# Altium schematic sheet Voltage_inverter.SchDoc
size A1
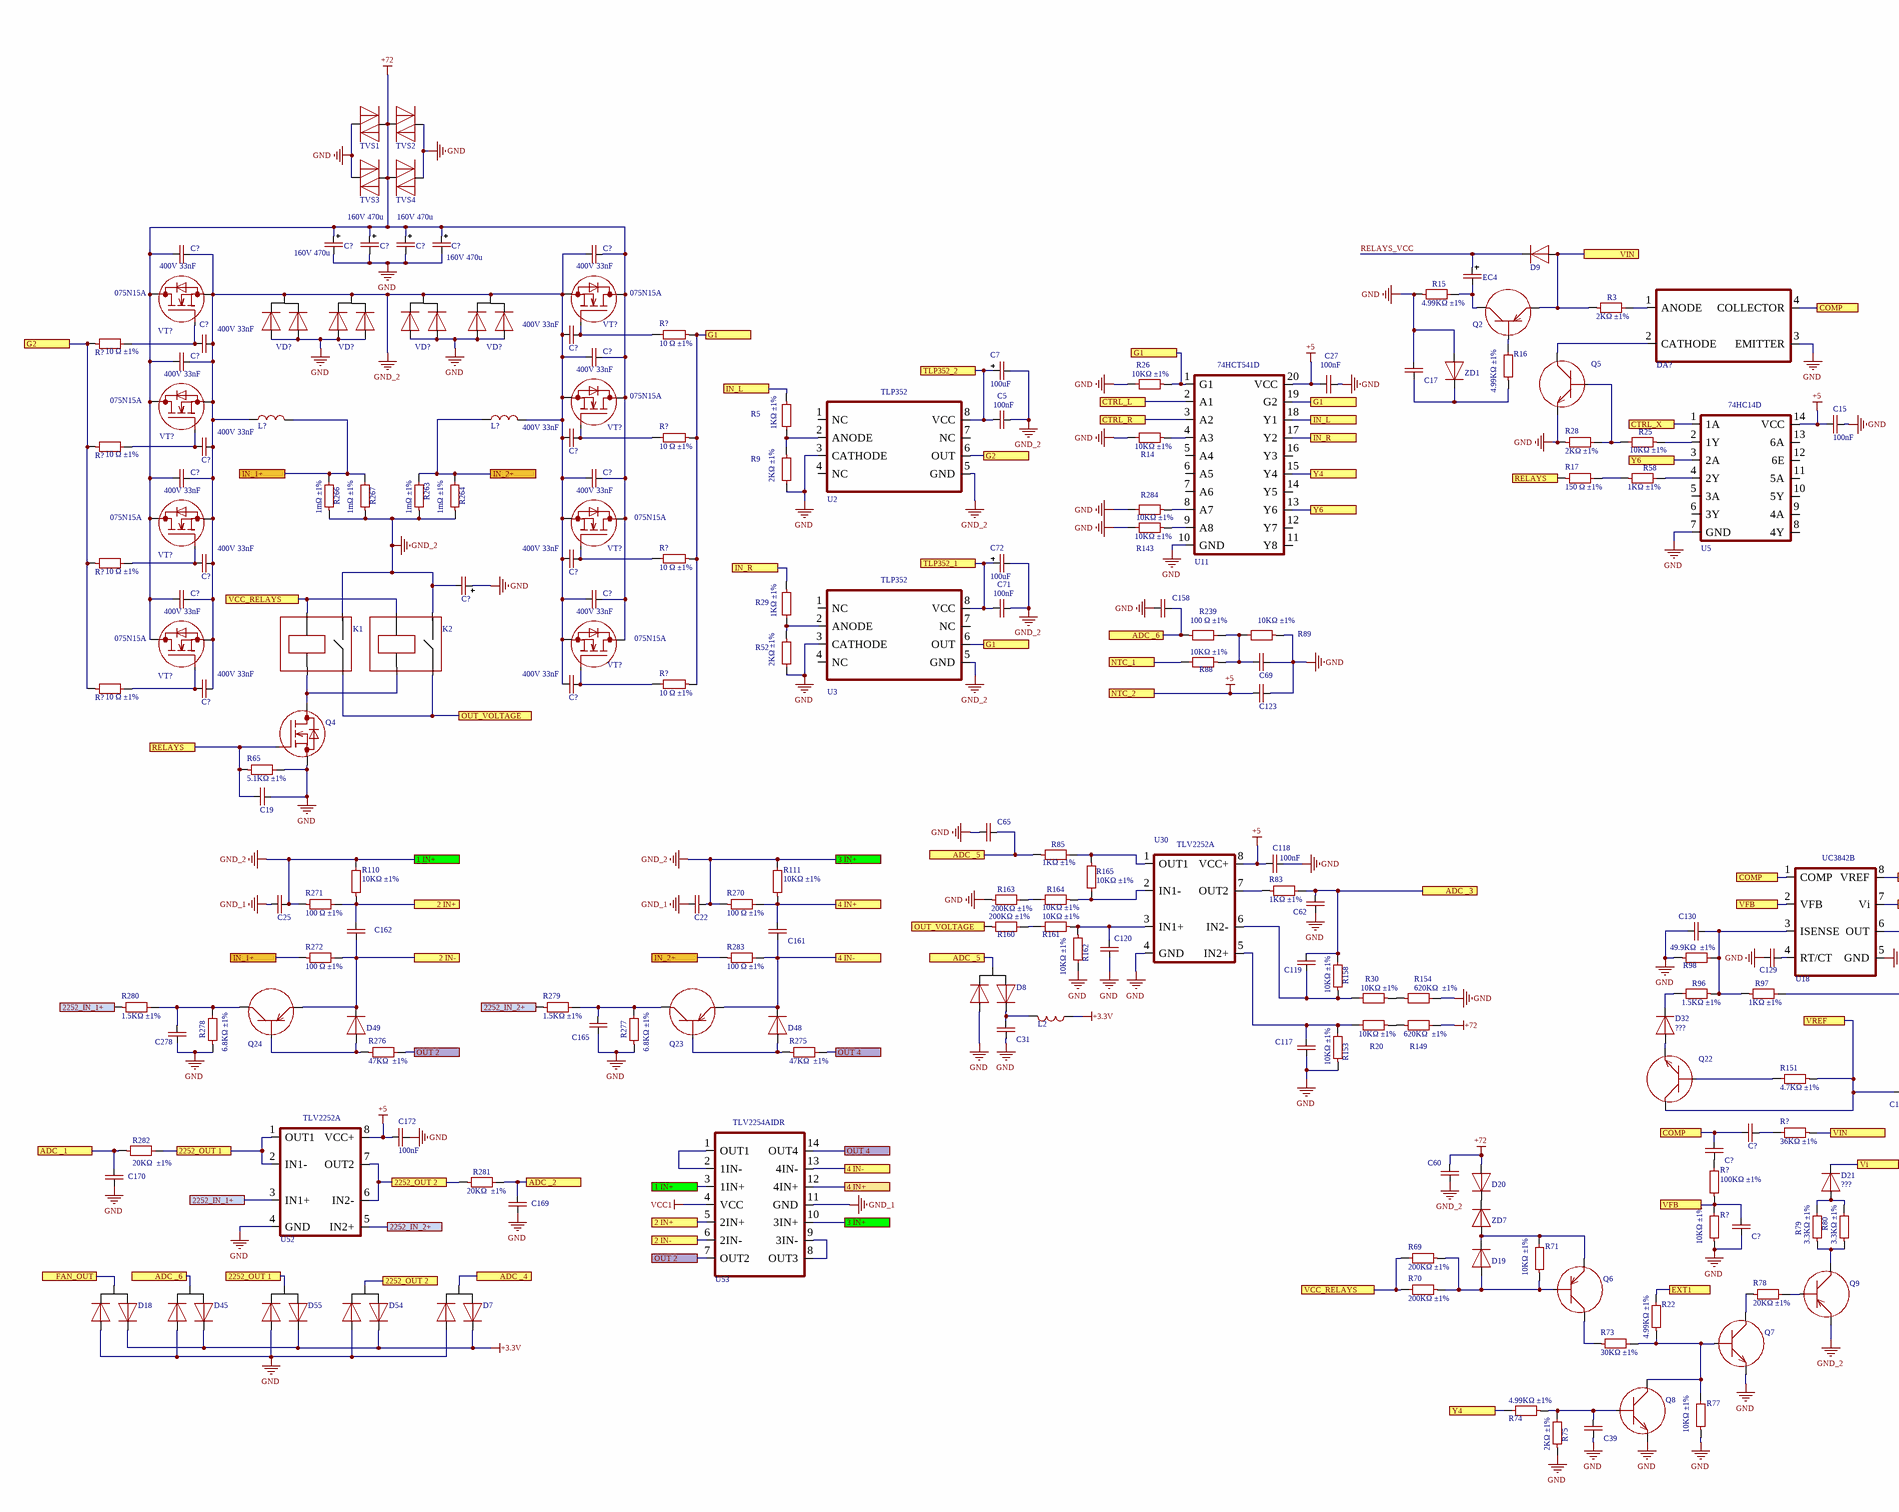
[diagram p0: Voltage_inverter.SchDoc, left]
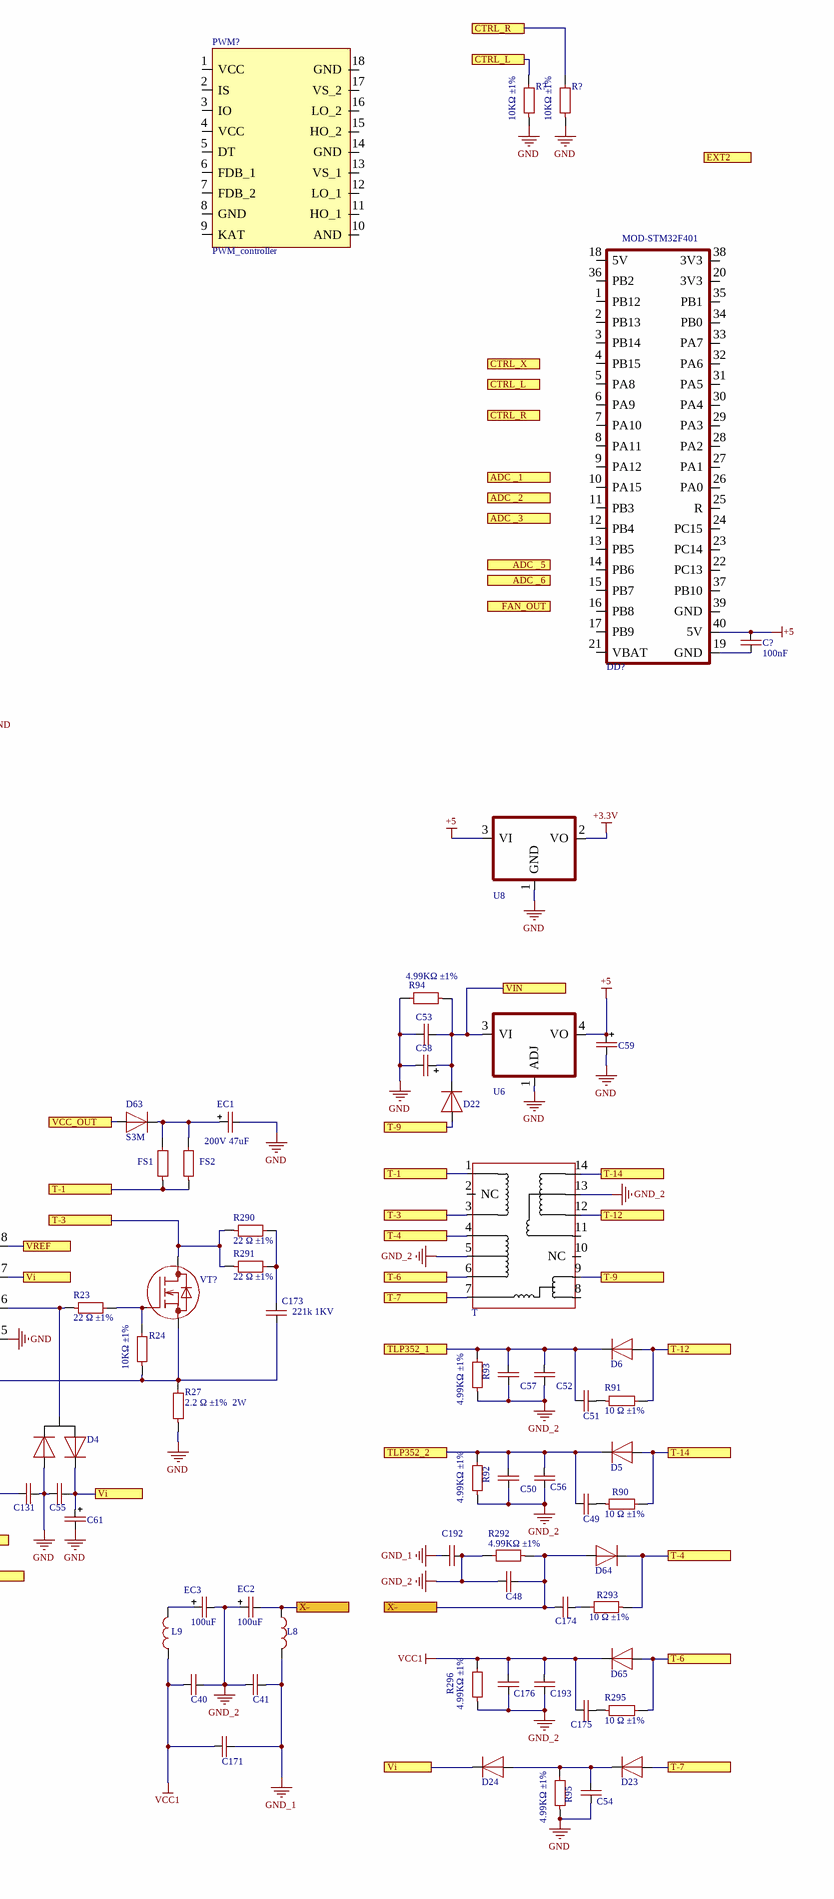
[diagram p1: Voltage_inverter.SchDoc, right]

## Parts
(Parts that share a designator on the sheet are numbered #1, #2 ... from top to bottom, then left to right.)
C5  100nF  [CAP-0603]
C7  value 100uF  [CAPPOL-18x40]  (hidden comment: CAP-POLAR)
C15  100nF  [CAP-0603]
C17  CAP-NON-POLAR  [CAP-0603]  (value not drawn)
C19  CAP-NON-POLAR  [CAP-0603]  (value not drawn)
C22  CAP-NON-POLAR  [CAP-0603]  (value not drawn)
C25  CAP-NON-POLAR  [CAP-0603]  (value not drawn)
C27  100nF  [CAP-0603]
C31  CAP-NON-POLAR  [CAP-0603]  (value not drawn)
C39  CAP-NON-POLAR  [CAP-0603]  (value not drawn)
C40  CAP-NON-POLAR  [CAP-0603]  (value not drawn)
C41  CAP-NON-POLAR  [CAP-0603]  (value not drawn)
C48  CAP-NON-POLAR  [CAP-0603]  (value not drawn)
C49  CAP-NON-POLAR  [CAP-0603]  (value not drawn)
C50  CAP-NON-POLAR  [CAP-0603]  (value not drawn)
C51  CAP-NON-POLAR  [CAP-0603]  (value not drawn)
C52  CAP-NON-POLAR  [CAP-0603]  (value not drawn)
C53  CAP-NON-POLAR  [CAP-0603]  (value not drawn)
C54  CAP-NON-POLAR  [CAP-0603]  (value not drawn)
C55  CAP-NON-POLAR  [CAP-0603]  (value not drawn)
C56  CAP-NON-POLAR  [CAP-0603]  (value not drawn)
C57  CAP-NON-POLAR  [CAP-0603]  (value not drawn)
C58  CAP-POLAR  [CAPPOL-10x18]  (value not drawn)
C59  CAP-POLAR  [CAPPOL-6x12]  (value not drawn)
C60  CAP-NON-POLAR  [CAP-0603]  (value not drawn)
C61  CAP-POLAR  [CAPPOL-6x12]  (value not drawn)
C62  CAP-NON-POLAR  [CAP-0603]  (value not drawn)
C65  CAP-NON-POLAR  [CAP-0603]  (value not drawn)
C69  CAP-NON-POLAR  [CAP-0603]  (value not drawn)
C71  100nF  [CAP-0603]
C72  value 100uF  [CAPPOL-18x40]  (hidden comment: CAP-POLAR)
C117  CAP-NON-POLAR  [CAP-0603]  (value not drawn)
C118  100nF  [CAP-0603]
C119  CAP-NON-POLAR  [CAP-0603]  (value not drawn)
C120  CAP-NON-POLAR  [CAP-0603]  (value not drawn)
C123  CAP-NON-POLAR  [CAP-0603]  (value not drawn)
C129  CAP-NON-POLAR  [CAP-0603]  (value not drawn)
C130  CAP-NON-POLAR  [CAP-0603]  (value not drawn)
C131  CAP-NON-POLAR  [CAP-0603]  (value not drawn)
C158  CAP-NON-POLAR  [CAP-0603]  (value not drawn)
C161  CAP-NON-POLAR  [CAP-0603]  (value not drawn)
C162  CAP-NON-POLAR  [CAP-0603]  (value not drawn)
C165  CAP-NON-POLAR  [CAP-0603]  (value not drawn)
C169  CAP-NON-POLAR  [CAP-0603]  (value not drawn)
C170  CAP-NON-POLAR  [CAP-0603]  (value not drawn)
C171  CAP-NON-POLAR  [CAP-0603]  (value not drawn)
C172  100nF  [CAP-0603]
C173  221k 1KV  [CAP-0603]
C174  CAP-NON-POLAR  [CAP-0603]  (value not drawn)
C175  CAP-NON-POLAR  [CAP-0603]  (value not drawn)
C176  CAP-NON-POLAR  [CAP-0603]  (value not drawn)
C192  CAP-NON-POLAR  [CAP-0603]  (value not drawn)
C193  CAP-NON-POLAR  [CAP-0603]  (value not drawn)
C278  CAP-NON-POLAR  [CAP-0603]  (value not drawn)
C?#1  value 160V 470u  [CAPPOL-18x40]  (hidden comment: CAP-POLAR)
C?#2  value 160V 470u  [CAPPOL-18x40]  (hidden comment: CAP-POLAR)
C?#3  value 160V 470u  [CAPPOL-18x40]  (hidden comment: CAP-POLAR)
C?#4  value 160V 470u  [CAPPOL-18x40]  (hidden comment: CAP-POLAR)
C?#5  value 400V 33nF  [CAP-1206]  (hidden comment: CAP-NON-POLAR)
C?#6  value 400V 33nF  [CAP-1206]  (hidden comment: CAP-NON-POLAR)
C?#7  value 400V 33nF  [CAP-1206]  (hidden comment: CAP-NON-POLAR)
C?#8  value 400V 33nF  [CAP-1206]  (hidden comment: CAP-NON-POLAR)
C?#9  100nF  [CAP-0603]
C?#10  value 400V 33nF  [CAP-1206]  (hidden comment: CAP-NON-POLAR)
C?#11  value 400V 33nF  [CAP-1206]  (hidden comment: CAP-NON-POLAR)
C?#12  value 400V 33nF  [CAP-1206]  (hidden comment: CAP-NON-POLAR)
C?#13  value 400V 33nF  [CAP-1206]  (hidden comment: CAP-NON-POLAR)
C?#14  value 400V 33nF  [CAP-1206]  (hidden comment: CAP-NON-POLAR)
C?#15  value 400V 33nF  [CAP-1206]  (hidden comment: CAP-NON-POLAR)
C?#16  value 400V 33nF  [CAP-1206]  (hidden comment: CAP-NON-POLAR)
C?#17  value 400V 33nF  [CAP-1206]  (hidden comment: CAP-NON-POLAR)
C?#18  CAP-POLAR  [CAPPOL-13x25]  (value not drawn)
C?#19  value 400V 33nF  [CAP-1206]  (hidden comment: CAP-NON-POLAR)
C?#20  value 400V 33nF  [CAP-1206]  (hidden comment: CAP-NON-POLAR)
C?#21  value 400V 33nF  [CAP-1206]  (hidden comment: CAP-NON-POLAR)
C?#22  value 400V 33nF  [CAP-1206]  (hidden comment: CAP-NON-POLAR)
C?#23  CAP-NON-POLAR  [CAP-0603]  (value not drawn)
C?#24  CAP-NON-POLAR  [CAP-0603]  (value not drawn)
C?#25  CAP-NON-POLAR  [CAP-0603]  (value not drawn)
D4  DIODE-4  [SOT23-3]  (value not drawn)
D5  DIODE  [DO-214AC, SMA]  (value not drawn)
D6  DIODE  [DO-214AC, SMA]  (value not drawn)
D7  DIODE-4  [SOT23-3]  (value not drawn)
D8  DIODE-4  [SOT23-3]  (value not drawn)
D9  DIODE  [SOD-123]  (value not drawn)
D18  DIODE-4  [SOT23-3]  (value not drawn)
D19  DIODE  [SOD-123]  (value not drawn)
D20  DIODE  [SOD-123]  (value not drawn)
D21  ???
D22  DIODE  [DO-214AC, SMA]  (value not drawn)
D23  DIODE  [DO-214AC, SMA]  (value not drawn)
D24  DIODE  [DO-214AC, SMA]  (value not drawn)
D32  ???
D45  DIODE-4  [SOT23-3]  (value not drawn)
D48  DIODE  (value not drawn)
D49  DIODE  (value not drawn)
D54  DIODE-4  [SOT23-3]  (value not drawn)
D55  DIODE-4  [SOT23-3]  (value not drawn)
D63  S3M  [DO-214AB]
D64  DIODE  [DO-214AC, SMA]  (value not drawn)
D65  DIODE  [DO-214AC, SMA]  (value not drawn)
DA?  PC817  [4-SMD]  (value not drawn)
DD?  MOD-STM32F401  [MOD-STM32F401]
EC1  value 200V 47uF  [CAPPOL-18x40]  (hidden comment: CAP-POLAR)
EC2  value 100uF  [CAPPOL-18x40]  (hidden comment: CAP-POLAR)
EC3  value 100uF  [CAPPOL-18x40]  (hidden comment: CAP-POLAR)
EC4  CAP-POLAR  [CAPPOL-6x12]  (value not drawn)
FS1  RES-CONST  [RES-0603]  (value not drawn)
FS2  RES-CONST  [RES-0603]  (value not drawn)
K1  RELAY  [HFV7-P]  (value not drawn)
K2  RELAY  [HFV7-P]  (value not drawn)
L2  IND-CONST  (value not drawn)
L8  IND-CONST  (value not drawn)
L9  IND-CONST  (value not drawn)
L?#1  IND-CONST  (value not drawn)
L?#2  IND-CONST  (value not drawn)
PWM?  PWM_controller  [PWM_controller]
Q2  BIPOLAR-PNP-BEC  [SOT23-3]  (value not drawn)
Q4  MOSFET-N-GDS  [SOT-223-3]  (value not drawn)
Q5  BIPOLAR-NPN-BEC  [SOT23-3]  (value not drawn)
Q6  BIPOLAR-PNP-BEC  [SOT23-3]  (value not drawn)
Q7  BIPOLAR-NPN-BEC  [SOT23-3]  (value not drawn)
Q8  BIPOLAR-NPN-BEC  [SOT23-3]  (value not drawn)
Q9  BIPOLAR-PNP-BEC  [SOT23-3]  (value not drawn)
Q22  BIPOLAR-NPN-BEC  [SOT23-3]  (value not drawn)
Q23  BIPOLAR-PNP-BEC  [SOT23-3]  (value not drawn)
Q24  BIPOLAR-PNP-BEC  [SOT23-3]  (value not drawn)
R3  value 2KΩ ±1%  [RES-0603]  (hidden comment: RES-CONST)
R5  1KΩ ±1%  [RES-0603]
R9  2KΩ ±1%  [RES-0603]
R14  value 10KΩ ±1%  [RES-0603]  (hidden comment: RES-CONST)
R15  value 4.99KΩ ±1%  [RES-0603]  (hidden comment: RES-CONST)
R16  value 4.99KΩ ±1%  [RES-0603]  (hidden comment: RES-CONST)
R17  value 150 Ω ±1%  [RES-0603]  (hidden comment: RES-CONST)
R20  value 10KΩ ±1%  [RES-0603]  (hidden comment: RES-CONST)
R22  value 4.99KΩ ±1%  [RES-0603]  (hidden comment: RES-CONST)
R23  value 22 Ω ±1%  [RES-0603]  (hidden comment: RES-CONST)
R24  value 10KΩ ±1%  [RES-0603]  (hidden comment: RES-CONST)
R25  value 10KΩ ±1%  [RES-0603]  (hidden comment: RES-CONST)
R26  value 10KΩ ±1%  [RES-0603]  (hidden comment: RES-CONST)
R27  value 2.2 Ω ±1%  2W  [RES-0603]  (hidden comment: RES-CONST)
R28  value 2KΩ ±1%  [RES-0603]  (hidden comment: RES-CONST)
R29  1KΩ ±1%  [RES-0603]
R30  value 10KΩ ±1%  [RES-0603]  (hidden comment: RES-CONST)
R52  2KΩ ±1%  [RES-0603]
R58  value 1KΩ ±1%  [RES-0603]  (hidden comment: RES-CONST)
R65  value 5.1KΩ ±1%  [RES-0603]  (hidden comment: RES-CONST)
R69  value 200KΩ ±1%  [RES-1206]  (hidden comment: RES-CONST)
R70  value 200KΩ ±1%  [RES-1206]  (hidden comment: RES-CONST)
R71  value 10KΩ ±1%  [RES-0603]  (hidden comment: RES-CONST)
R73  value 30KΩ ±1%  [RES-2512]  (hidden comment: RES-CONST)
R74  value 4.99KΩ ±1%  [RES-0603]  (hidden comment: RES-CONST)
R75  value 2KΩ ±1%  [RES-0603]  (hidden comment: RES-CONST)
R77  value 10KΩ ±1%  [RES-0603]  (hidden comment: RES-CONST)
R78  value 20KΩ ±1%  [RES-1206]  (hidden comment: RES-CONST)
R79  value 3.3KΩ ±1%  [RES-1206]  (hidden comment: RES-CONST)
R80  value 3.3KΩ ±1%  [RES-1206]  (hidden comment: RES-CONST)
R83  1KΩ ±1%  [RES-0603]
R85  1KΩ ±1%  [RES-0603]
R88  value 10KΩ ±1%  [RES-0603]  (hidden comment: RES-CONST)
R89  value 10KΩ ±1%  [RES-0603]  (hidden comment: RES-CONST)
R90  value 10 Ω ±1%  [RES-0603]  (hidden comment: RES-CONST)
R91  value 10 Ω ±1%  [RES-0603]  (hidden comment: RES-CONST)
R92  value 4.99KΩ ±1%  [RES-0603]  (hidden comment: RES-CONST)
R93  value 4.99KΩ ±1%  [RES-0603]  (hidden comment: RES-CONST)
R94  value 4.99KΩ ±1%  [RES-0603]  (hidden comment: RES-CONST)
R95  value 4.99KΩ ±1%  [RES-0603]  (hidden comment: RES-CONST)
R96  value 1.5KΩ ±1%  [RES-0603]  (hidden comment: RES-CONST)
R97  value 1KΩ ±1%  [RES-0603]  (hidden comment: RES-CONST)
R98  value 49.9KΩ  ±1%  [RES-0603]  (hidden comment: RES-CONST)
R110  value 10KΩ ±1%  [RES-0603]  (hidden comment: RES-CONST)
R111  value 10KΩ ±1%  [RES-0603]  (hidden comment: RES-CONST)
R143  value 10KΩ ±1%  [RES-0603]  (hidden comment: RES-CONST)
R149  value 620KΩ  ±1%  [RES-0603]  (hidden comment: RES-CONST)
R151  value 4.7KΩ ±1%  [RES-0603]  (hidden comment: RES-CONST)
R153  value 10KΩ ±1%  [RES-0603]  (hidden comment: RES-CONST)
R154  value 620KΩ  ±1%  [RES-0603]  (hidden comment: RES-CONST)
R158  value 10KΩ ±1%  [RES-0603]  (hidden comment: RES-CONST)
R160  value 200KΩ ±1%  [RES-0603]  (hidden comment: RES-CONST)
R161  value 10KΩ ±1%  [RES-0603]  (hidden comment: RES-CONST)
R162  value 10KΩ ±1%  [RES-0603]  (hidden comment: RES-CONST)
R163  value 200KΩ ±1%  [RES-0603]  (hidden comment: RES-CONST)
R164  value 10KΩ ±1%  [RES-0603]  (hidden comment: RES-CONST)
R165  value 10KΩ ±1%  [RES-0603]  (hidden comment: RES-CONST)
R239  value 100 Ω ±1%  [RES-0603]  (hidden comment: RES-CONST)
R263  value 1mΩ ±1%  [RES-3921]  (hidden comment: RES-CONST)
R264  value 1mΩ ±1%  [RES-3921]  (hidden comment: RES-CONST)
R266  value 1mΩ ±1%  [RES-3921]  (hidden comment: RES-CONST)
R267  value 1mΩ ±1%  [RES-3921]  (hidden comment: RES-CONST)
R270  value 100 Ω ±1%  [RES-0603]  (hidden comment: RES-CONST)
R271  value 100 Ω ±1%  [RES-0603]  (hidden comment: RES-CONST)
R272  value 100 Ω ±1%  [RES-0603]  (hidden comment: RES-CONST)
R275  value 47KΩ  ±1%  [RES-0603]  (hidden comment: RES-CONST)
R276  value 47KΩ  ±1%  [RES-0603]  (hidden comment: RES-CONST)
R277  value 6.8KΩ ±1%  [RES-0603]  (hidden comment: RES-CONST)
R278  value 6.8KΩ ±1%  [RES-0603]  (hidden comment: RES-CONST)
R279  value 1.5KΩ ±1%  [RES-0603]  (hidden comment: RES-CONST)
R280  value 1.5KΩ ±1%  [RES-0603]  (hidden comment: RES-CONST)
R281  value 20KΩ  ±1%  [RES-0805]  (hidden comment: RES-CONST)
R282  value 20KΩ  ±1%  [RES-0805]  (hidden comment: RES-CONST)
R283  value 100 Ω ±1%  [RES-0603]  (hidden comment: RES-CONST)
R284  value 10KΩ ±1%  [RES-0603]  (hidden comment: RES-CONST)
R290  value 22 Ω ±1%  [RES-0603]  (hidden comment: RES-CONST)
R291  value 22 Ω ±1%  [RES-0603]  (hidden comment: RES-CONST)
R292  value 4.99KΩ ±1%  [RES-0603]  (hidden comment: RES-CONST)
R293  value 10 Ω ±1%  [RES-0603]  (hidden comment: RES-CONST)
R295  value 10 Ω ±1%  [RES-0603]  (hidden comment: RES-CONST)
R296  value 4.99KΩ ±1%  [RES-0603]  (hidden comment: RES-CONST)
R?#1  value 10KΩ ±1%  [RES-0603]  (hidden comment: RES-CONST)
R?#2  value 10KΩ ±1%  [RES-0603]  (hidden comment: RES-CONST)
R?#3  10 Ω ±1%  [RES-0603]
R?#4  10 Ω ±1%  [RES-0603]
R?#5  10 Ω ±1%  [RES-0603]
R?#6  10 Ω ±1%  [RES-0603]
R?#7  10 Ω ±1%  [RES-0603]
R?#8  10 Ω ±1%  [RES-0603]
R?#9  10 Ω ±1%  [RES-0603]
R?#10  10 Ω ±1%  [RES-0603]
R?#11  value 36KΩ ±1%  [RES-0603]  (hidden comment: RES-CONST)
R?#12  value 100KΩ ±1%  [RES-0603]  (hidden comment: RES-CONST)
R?#13  value 10KΩ ±1%  [RES-0603]  (hidden comment: RES-CONST)
T  TRANS_VI  [TRANS_VI]  (value not drawn)
TVS1  DIODE-3  [DO-214AB]  (value not drawn)
TVS2  DIODE-3  [DO-214AB]  (value not drawn)
TVS3  DIODE-3  [DO-214AB]  (value not drawn)
TVS4  DIODE-3  [DO-214AB]  (value not drawn)
U2  TLP352  [TLP352]
U3  TLP352  [TLP352]
U5  74HC14D  [SOIC14]
U6  NCV33269DTRK5.0G  [DPAK]  (value not drawn)
U8  AMS1117  [SOT-223-3]  (value not drawn)
U11  74HCT541D  [SOP-20]
U18  UC3842B  [SOIC8-150]
U30  TLV2252A  [SOIC8-150]
U52  TLV2252A  [SOIC8-150]
U53  TLV2254AIDR  [SOIC14]
VD?#1  DIODE-2  [TO-247-3]  (value not drawn)
VD?#2  DIODE-2  [TO-247-3]  (value not drawn)
VD?#3  DIODE-2  [TO-247-3]  (value not drawn)
VD?#4  DIODE-2  [TO-247-3]  (value not drawn)
VT?#1  value 075N15A  [TO-220-3]  (hidden comment: MOSFET-N-GDS)
VT?#2  value 075N15A  [TO-220-3]  (hidden comment: MOSFET-N-GDS)
VT?#3  value 075N15A  [TO-220-3]  (hidden comment: MOSFET-N-GDS)
VT?#4  value 075N15A  [TO-220-3]  (hidden comment: MOSFET-N-GDS)
VT?#5  value 075N15A  [TO-220-3]  (hidden comment: MOSFET-N-GDS)
VT?#6  value 075N15A  [TO-220-3]  (hidden comment: MOSFET-N-GDS)
VT?#7  value 075N15A  [TO-220-3]  (hidden comment: MOSFET-N-GDS)
VT?#8  value 075N15A  [TO-220-3]  (hidden comment: MOSFET-N-GDS)
VT?#9  MOSFET-N-GDS  [TO-220-3]  (value not drawn)
ZD1  DIODE  [SOD-123]  (value not drawn)
ZD7  DIODE  [SOD-123]  (value not drawn)

## Ports
1 IN+, 2 IN+, 2 IN-, 3 IN+, 4 IN+, 4 IN-, 2252_IN_1+, 2252_IN_2+, 2252_OUT 1, 2252_OUT 2, ADC _1, ADC _2, ADC _3, ADC _4, ADC _5, ADC _6, COMP, CTRL_L, CTRL_R, CTRL_X, EXT1, EXT2, FAN_OUT, G1, G2, IN_1+, IN_2+, IN_L, IN_R, NTC_1, NTC_2, OUT 2, OUT 4, OUT_VOLTAGE, RELAYS, T-1, T-3, T-4, T-6, T-7, T-9, T-12, T-14, TLP352_1, TLP352_2, VCC_OUT, VCC_RELAYS, VFB, Vi, VIN, VREF, X-, Y4, Y6

## Nets
+3.3V: D7.2(C) D18.2(C) D45.2(C) D54.2(C) D55.2(C) L2.1 U8.2(VO)
+5: C15.2 C27.2 C59.1(+) C118.2 C123.2 C172.2 C?#9.2 DD?.40(5V) U5.14(VCC) U6.4(VO) U8.3(VI) U11.20(VCC) U30.8(VCC+) U52.8(VCC+) ; port NTC_2
+72: C60.2 C?#1.1(+) C?#2.1(+) C?#3.1(+) C?#4.1(+) C?#5.1 C?#6.2 C?#10.2 C?#11.1 C?#14.1 C?#15.2 C?#19.1 C?#20.2 D20.2(A) R149.2 TVS1.2(A) TVS2.1(C) TVS3.2(A) TVS4.1(C) VT?#1.2(D) VT?#2.2(D) VT?#3.2(D) VT?#4.2(D) VT?#5.2(D) VT?#6.2(D) VT?#7.2(D) VT?#8.2(D)
GND: C15.1 C17.1 C19.2 C27.1 C31.1 C39.2 C53.2 C54.1 C55.2 C58.2(-) C59.2(-) C61.2(-) C62.2 C65.1 C69.1 C117.1 C118.1 C120.1 C123.1 C129.2 C130.2 C131.1 C158.2 C165.1 C169.2 C170.2 C172.1 C278.1 C?#1.2(-) C?#2.2(-) C?#3.2(-) C?#4.2(-) C?#18.1(+) C?#25.2 D4.1(A) D7.1(A) D8.1(A) D18.1(A) D45.1(A) D54.1(A) D55.1(A) DA?.3(EMITTER) EC1.2(-) Q4.3(S) Q5.2(E) Q7.2(E) Q8.2(E) R9.2 R14.2 R15.1 R26.2 R27.1 R28.1 R52.2 R65.2 R75.1 R77.1 R89.1 R94.2 R95.1 R98.1 R143.2 R153.1 R154.2 R162.2 R163.1 R277.1 R278.1 R284.2 R?#1.1 R?#2.1 R?#13.1 TVS1.1(C) TVS2.2(A) TVS3.1(C) TVS4.2(A) U2.3(CATHODE) U3.3(CATHODE) U5.7(GND) U6.1(ADJ) U8.1(GND) U11.10(GND) U18.5(GND) U30.4(GND) U52.4(GND) VD?#1.1(A) VD?#1.3(A) VD?#2.1(A) VD?#2.3(A) VD?#3.1(A) VD?#3.3(A) VD?#4.1(A) VD?#4.3(A) ZD1.2(A)
GND_1: C22.1 C25.2 C41.1 C171.1 C192.2 L8.2 U53.11(GND)
GND_2: C5.2 C7.2(-) C22.2 C25.1 C40.1 C41.2 C48.2 C50.1 C52.1 C56.1 C57.1 C60.1 C71.2 C72.2(-) C176.1 C192.1 C193.1 C?#5.2 C?#6.1 C?#7.1 C?#8.2 C?#10.1 C?#11.2 C?#12.1 C?#13.2 C?#14.2 C?#15.1 C?#16.1 C?#17.2 C?#18.2(-) C?#19.2 C?#20.1 C?#21.1 C?#22.2 EC2.1(+) EC3.2(-) K1.86 K2.86 L?#1.1 L?#2.1 Q9.2(E) R92.1 R93.1 R110.2 R111.2 R263.1 R264.1 R266.1 R267.1 R270.1 R271.1 R292.2 R296.1 T.5(A) T.13(A) U2.5(GND) U3.5(GND) U53.3(1IN+) U53.10(3IN+) VD?#1.2(C) VD?#2.2(C) VD?#3.2(C) VD?#4.2(C) VT?#1.3(S) VT?#2.3(S) VT?#3.3(S) VT?#4.3(S) VT?#5.3(S) VT?#6.3(S) VT?#7.3(S) VT?#8.3(S) ; port 3 IN+, port 1 IN+
VCC1: C40.2 C171.2 C175.2 C176.2 C193.2 D65.1(C) L9.1 R296.2 U53.4(VCC)
2 IN+: C162.2 R110.1 R271.2 U53.5(2IN+) ; port 2 IN+
2 IN-: C162.1 D49.1(C) Q24.2(E) R272.2 U53.6(2IN-) ; port 2 IN-
4 IN+: C161.2 R111.1 R270.2 U53.12(4IN+) ; port 4 IN+
4 IN-: C161.1 D48.1(C) Q23.2(E) R283.2 U53.13(4IN-) ; port 4 IN-
2252_IN_1+: R280.1 U52.3(IN1+) ; port 2252_IN_1+
2252_IN_2+: R279.1 U52.5(IN2+) ; port 2252_IN_2+
2252_OUT 1: D55.3(x) R282.2 U52.1(OUT1) U52.2(IN1-) ; port 2252_OUT 1
2252_OUT 2: D54.3(x) R281.1 U52.6(IN2-) U52.7(OUT2) ; port 2252_OUT 2
ADC _1: C170.1 R282.1 ; port ADC _1
ADC _2: C169.1 R281.2 ; port ADC _2
ADC _3: C62.1 C119.2 R83.2 R158.2 ; port ADC _3
ADC _4: D7.3(x) ; port ADC _4
ADC _5: C65.2 D8.3(x) R85.1 ; port ADC _5
ADC _6: C158.1 D45.3(x) R239.1 ; port ADC _6
COMP: C?#23.1 C?#24.1 DA?.4(COLLECTOR) U18.1(COMP) ; port COMP
CTRL_L: R?#1.2 U11.2(A1) ; port CTRL_L
CTRL_R: R?#2.2 U11.3(A2) ; port CTRL_R
CTRL_X: U5.1(1A) ; port CTRL_X
EXT1: R22.2 ; port EXT1
FAN_OUT: D18.3(x) ; port FAN_OUT
G1: R26.1 R?#3.1 R?#5.1 R?#7.1 R?#9.1 U3.6(OUT) U11.1(G1) U11.19(G2) ; port G1
G2: R?#4.1 R?#6.1 R?#8.1 R?#10.1 U2.6(OUT) ; port G2
IN_1+: L?#1.2 R266.2 R267.2 R272.1 ; port IN_1+
IN_2+: L?#2.2 R263.2 R264.2 R283.1 ; port IN_2+
IN_L: R5.1 U11.18(Y1) ; port IN_L
IN_R: R29.1 U11.17(Y2) ; port IN_R
NTC_1: R88.2 ; port NTC_1
OUT 2: R276.2 U53.7(OUT2) ; port OUT 2
OUT 4: R275.2 U53.14(OUT4) ; port OUT 4
OUT_VOLTAGE: K1.85 K2.85 R160.1 ; port OUT_VOLTAGE
RELAYS: C19.1 Q4.1(G) R17.1 R65.1 ; port RELAYS
RELAYS_VCC: D9.1(C) EC4.1(+)
T-1: FS1.1 FS2.1 T.1(A) ; port T-1
T-3: R290.1 R291.1 T.3(A) VT?#9.2(D) ; port T-3
T-4: D64.1(C) R293.1 T.4(A) ; port T-4
T-6: D65.2(A) R295.2 T.6(A) ; port T-6
T-7: D23.2(A) T.7(A) ; port T-7
T-9: D22.2(A) T.9(A) ; port T-9
T-12: D6.2(A) R91.2 T.12(A) ; port T-12
T-14: D5.2(A) R90.2 T.14(A) ; port T-14
TLP352_1: C51.2 C52.2 C57.2 C71.1 C72.1(+) D6.1(C) R93.2 U3.8(VCC) ; port TLP352_1
TLP352_2: C5.1 C7.1(+) C49.2 C50.2 C56.2 D5.1(C) R92.2 U2.8(VCC) ; port TLP352_2
VCC_OUT: D63.2(A) ; port VCC_OUT
VCC_RELAYS: K1.87 K2.87 R69.2 R70.2 ; port VCC_RELAYS
VFB: C?#25.1 R?#12.1 R?#13.2 U18.2(VFB) ; port VFB
Vi: C55.1 C61.1(+) D4.2(C) D21.1(C) D24.1(C) U18.7(Vi) ; port Vi
VIN: C53.1 C58.1(+) D9.2(A) D22.1(C) Q2.2(E) R3.1 R94.1 R?#11.1 U6.3(VI) ; port VIN
VREF: C131.2 Q22.3(C) R151.1 U18.8(VREF) ; port VREF
X-: C48.1 C174.1 D64.2(A) EC2.2(-) L8.1 R292.1 ; port X-
Y4: R74.2 U11.15(Y4) ; port Y4
Y6: U5.3(2A) U11.13(Y6) ; port Y6
NetC17_2: C17.2 R16.1 ZD1.1(C)
NetC31_2: C31.2 D8.2(C) L2.2
NetC39_1: C39.1 Q8.1(B) R74.1 R75.2
NetC49_1: C49.1 R90.1
NetC51_1: C51.1 R91.1
NetC54_2: C54.2 D23.1(C) D24.2(A) R95.2
NetC69_2: C69.2 R88.1 R89.2 R239.2
NetC117_2: C117.2 R20.2 R153.2 U30.5(IN2+)
NetC119_1: C119.1 R30.2 R158.1 U30.6(IN2-)
NetC120_2: C120.2 R161.1 R162.1 U30.3(IN1+)
NetC129_1: C129.1 U18.4(RT/CT)
NetC130_1: C130.1 R96.1 R97.1 R98.2 U18.3(ISENSE)
NetC165_2: C165.2 Q23.3(C) R277.2 R279.2
NetC173_1: C173.1 R290.2 R291.2
NetC173_2: C173.2 R24.1 R27.2 R97.2 VT?#9.3(S)
NetC174_2: C174.2 R293.2
NetC175_1: C175.1 R295.1
NetC278_2: C278.2 Q24.3(C) R278.2 R280.2
NetC?#7_2: C?#7.2 R?#3.2 VT?#2.1(G)
NetC?#8_1: C?#8.1 R?#4.2 VT?#1.1(G)
NetC?#9_1: C?#9.1 DD?.19(GND)
NetC?#12_2: C?#12.2 R?#5.2 VT?#3.1(G)
NetC?#13_1: C?#13.1 R?#6.2 VT?#4.1(G)
NetC?#16_2: C?#16.2 R?#7.2 VT?#6.1(G)
NetC?#17_1: C?#17.1 R?#8.2 VT?#5.1(G)
NetC?#21_2: C?#21.2 R?#9.2 VT?#8.1(G)
NetC?#22_1: C?#22.1 R?#10.2 VT?#7.1(G)
NetC?#23_2: C?#23.2 R?#11.2
NetC?#24_2: C?#24.2 R?#12.2
NetD4_3: D4.3(x) R23.1 U18.6(OUT)
NetD19_1: D19.1(C) Q6.2(E) R71.2 ZD7.2(A)
NetD19_2: D19.2(A) Q6.1(B) R69.1 R70.1 R71.1
NetD20_1: D20.1(C) ZD7.1(C)
NetD21_2: D21.2(A) R79.2 R80.2
NetD32_1: D32.1(C) R96.2
NetD32_2: D32.2(A) Q22.2(E)
NetD48_2: D48.2(A) Q23.1(B) R275.1
NetD49_2: D49.2(A) Q24.1(B) R276.1
NetD63_1: D63.1(C) EC1.1(+) FS1.2 FS2.2
NetDA?_1: DA?.1(ANODE) R3.2
NetDA?_2: DA?.2(CATHODE) Q5.3(C)
NetEC3_1: EC3.1(+) L9.2
NetEC4_2: EC4.2(-) Q2.3(C) R15.2
NetK1_30: K1.30 K2.30 Q4.2(D)
NetQ2_1: Q2.1(B) R16.2
NetQ5_1: Q5.1(B) R25.2 R28.2
NetQ6_3: Q6.3(C) R73.1
NetQ7_1: Q7.1(B) Q8.3(C) R22.1 R73.2 R77.2
NetQ7_3: Q7.3(C) R78.1
NetQ9_1: Q9.1(B) R78.2
NetQ9_3: Q9.3(C) R79.1 R80.1
NetQ22_1: Q22.1(B) R151.2
NetR5_2: R5.2 R9.1 U2.2(ANODE)
NetR14_1: R14.1 U11.4(A3)
NetR17_2: R17.2 R58.1
NetR20_1: R20.1 R149.1
NetR23_2: R23.2 R24.2 VT?#9.1(G)
NetR25_1: R25.1 U5.2(1Y)
NetR29_2: R29.2 R52.1 U3.2(ANODE)
NetR30_1: R30.1 R154.1
NetR58_2: R58.2 U5.4(2Y)
NetR83_1: R83.1 U30.7(OUT2)
NetR85_2: R85.2 R165.1 U30.1(OUT1)
NetR143_1: R143.1 U11.9(A8)
NetR160_2: R160.2 R161.2
NetR163_2: R163.2 R164.2
NetR164_1: R164.1 R165.2 U30.2(IN1-)
NetR284_1: R284.1 U11.8(A7)
NetU53_1: U53.1(OUT1) U53.2(1IN-)
NetU53_8: U53.8(OUT3) U53.9(3IN-)

Not connected (* = marked no-connect by the designer): DD? 1(PB12) 2(PB13) 3(PB14) 4(PB15) 5(PA8) 6(PA9) 7(PA10) 8(PA11) 9(PA12) 10(PA15) 11(PB3) 12(PB4) 13(PB5) 14(PB6) 15(PB7) 16(PB8) 17(PB9) 18(5V) 20(3V3) 21(VBAT) 22(PC13) 23(PC14) 24(PC15) 25(R) 26(PA0) 27(PA1) 28(PA2) 29(PA3) 30(PA4) 31(PA5) 32(PA6) 33(PA7) 34(PB0) 35(PB1) 36(PB2) 37(PB10) 38(3V3) 39(GND); PWM? 1(VCC) 2(IS) 3(IO) 4(VCC) 5(DT) 6(FDB_1) 7(FDB_2) 8(GND) 9(KAT) 10(AND) 11(HO_1) 12(LO_1) 13(VS_1) 14(GND) 15(HO_2) 16(LO_2) 17(VS_2) 18(GND); T 2(NC) 8(A) 10(NC) 11(A); U2 1(NC) 4(NC) 7(NC); U3 1(NC) 4(NC) 7(NC); U5 5(3A) 6(3Y) 8(4Y) 9(4A) 10(5Y) 11(5A) 12(6E) 13(6A); U11 5(A4) 6(A5) 7(A6) 11(Y8) 12(Y7) 14(Y5) 16(Y3)

## Library data of the parts
C5 C15 C27 C71 C118 C172 C?#9 = 2: №: 2; ID: C-0691; Value: 50V 100n; Part Number: 2
C7 C72 EC1-EC3 = 1: Part Number: 1; ID: C-0690; №: 1
C17 C19 C22 C25 C31 C39-C41 C48-C57 C60 C62 C65 C69 C117 C119 C120 C123 C129-C131 C158 C161 C162 C165 C169-C171 C173-C176 C192 C193 C278 C?#5-C?#8 C?#10-C?#17 C?#19-C?#25 = 5: Part Number: 5; ID: C-0694; №: 5
C58 = 10: Part Number: 10; Value: 35v 330uF; №: 10
C59 C61 EC4 = 11: Part Number: 11; Value: 25v 100uF; №: 11
C?#1-C?#4 = 1: №: 1; ID: C-0690; Part Number: 1
C?#18 = 12: Part Number: 12; Value: 80V 470uF; №: 12
D4 D7 D8 D18 D45 D54 D55 = BAT54S: Part Number: BAT54S; №: 5; ID: D-0747; Value: 30 V 200mA
D5 D6 D23 D24 D64 D65 = MURA120T3G: №: 6; ID: D-0748; Value: 200V 1A; Part Number: MURA120T3G
D9 D19 D20 = MMSD4148T1G: №: 8; ID: D-0750; Value: 100V 200mA; Part Number: MMSD4148T1G
D21 D32 = DIODE: №: 3; ID: D-0003; Value: DIODE; Part Number: DIODE
D22 = MURA220T3: №: 7; ID: D-0749; Value: 200V 2A; Part Number: MURA220T3
D48 D49 = DIODE: №: 3; ID: D-0003; Part Number: DIODE; Value: DIODE
D63 = S3M: №: 4; ID: D-0004; Value: 1000V 3A; Part Number: S3M
DA? = 1: Part Number: 1; ID: O-0001; №: 1
DD? = STM32F401: №: 1; ID: M-0001; Part Number: STM32F401; Value: STM32F401
FS1 FS2 R90 R91 R293 R295 = 1: Part Number: 1; ID: R-0001; №: 1
K1 K2 = HFV7-P: №: 1; ID: E-0001; Value: 12VDC 70A; Part Number: HFV7-P
L2 L8 L9 = 1: Part Number: 1; ID: L-0001; №: 1
L?#1 L?#2 = 1: №: 1; ID: L-0001; Part Number: 1
PWM? = PWM_controller: №: 2; ID: M-0002; Value: PWM; Part Number: PWM_controller
Q2 = MMBT2907: №: 7; ID: T-0007; Value: 60 V 600 Ma; Part Number: MMBT2907
Q4 = AP9997GK: №: 4; ID: T-0004; Value: 100V 3.2A; Part Number: AP9997GK
Q5 Q22 = PMST2222: №: 6; ID: T-0006; Value: 40 V 600 mA; Part Number: PMST2222
Q6 Q9 Q23 Q24 = MMBT5401: №: 3; ID: T-0003; Value: 150 V 600 mA; Part Number: MMBT5401
Q7 Q8 = MMBT5551: №: 5; ID: T-0005; Value: 160 V 600 Ma; Part Number: MMBT5551
R3 R28 R75 = 38: Part Number: 38; ID: R-0038; №: 38
R5 R29 R83 R85 = 37: №: 37; ID: R-0037; Part Number: 37; Value: 1KΩ ±1%
R9 R52 = 38: №: 38; ID: R-0038; Part Number: 38; Value: 2KΩ ±1%
R14 R20 R24-R26 R30 R71 R77 R88 R89 R110 R111 R143 R153 R158 R161 R162 R164 R165 R284 R?#1 R?#2 R?#13 = 50: Part Number: 50; ID: R-0050; №: 50
R15 R16 R22 R74 R92-R95 R151 R292 R296 = 42: Part Number: 42; ID: R-0042; №: 42
R17 = 18: Part Number: 18; ID: R-0018; №: 18
R23 R27 R290 R291 = 2: Part Number: 2; ID: R-0002; №: 2
R58 R96 R97 R279 R280 = 37: Part Number: 37; ID: R-0037; №: 37
R65 = 43: Part Number: 43; ID: R-0043; №: 43
R69 R70 = 203: Part Number: 203; ID: R-0203; №: 203
R73 = 202: Part Number: 202; ID: R-0202; №: 202
R78 = 201: Part Number: 201; ID: R-0201; №: 201
R79 R80 = 200: Part Number: 200; ID: R-0200; №: 200
R98 R275 R276 = 65: Part Number: 65; ID: R-0065; №: 65
R149 R154 = 81: Part Number: 81; ID: R-0081; №: 81
R160 R163 = 74: Part Number: 74; ID: R-0074; №: 74
R239 R270-R272 R283 = 14: Part Number: 14; ID: R-0014; №: 14
R263 R264 R266 R267 = PU3921FKMP90R001L: №: 199; ID: R-0199; Part Number: PU3921FKMP90R001L
R277 R278 = 46: Part Number: 46; ID: R-0046; №: 46
R281 R282 = 156: Part Number: 156; ID: R-0156; №: 156
R?#3-R?#10 = 1: №: 1; ID: R-0001; Part Number: 1; Value: 10 Ω ±1%
R?#11 = 62: Part Number: 62; ID: R-0062; №: 62
R?#12 = 73: Part Number: 73; ID: R-0073; №: 73
T = 1: №: 1; Value: XX; Part Number: 1
TVS1-TVS4 = SMCJ150CA: №: 2; ID: D-0002; Value: TVS 200v; Part Number: SMCJ150CA
U2 U3 = TLP352: №: 1; ID: I-0001; Part Number: TLP352; Value: TLP352
U5 = 74HC14D: №: 7; ID: I-0007; Part Number: 74HC14D; Value: 74HC14D
U6 = NCV33269DTRK5.0G: №: 6; ID: I-0006; Value: 5V; Part Number: NCV33269DTRK5.0G
U8 = AMS1117 3.3V: №: 8; ID: I-0008; Value: 3.3V; Part Number: AMS1117 3.3V
U11 = 74HCT541D: №: 2; ID: I-0002; Part Number: 74HCT541D; Value: 74HCT541D
U18 = UC3842B: №: 5; ID: I-0005; Part Number: UC3842B
U30 U52 = TLV2252A: №: 4; ID: I-0004; Part Number: TLV2252A; Value: TLV2252A
U53 = TLV2254AIDR: №: 3; ID: I-0003; Part Number: TLV2254AIDR; Value: TLV2254AIDR
VD?#1-VD?#4 = 80CPU02: №: 1; ID: D-0743; Value: 200V 40A; Part Number: 80CPU02
VT?#1-VT?#8 = 075N15A: №: 1; ID: T-0001; Part Number: 075N15A
VT?#9 = IRF640: Part Number: IRF640; №: 2; ID: T-0002; Value: 200V 18A
ZD1 = CZRW5256B-HF: №: 10; ID: D-0752; Value: Zener  30 V 350 mW; Part Number: CZRW5256B-HF
ZD7 = DDZ9678: №: 9; ID: D-0751; Part Number: DDZ9678